# EAGLE design RDF4463_Beacon_v1 (EAGLE 6.5.0)
DRF4463F (si4463) APRS/CW Beacon Test Board
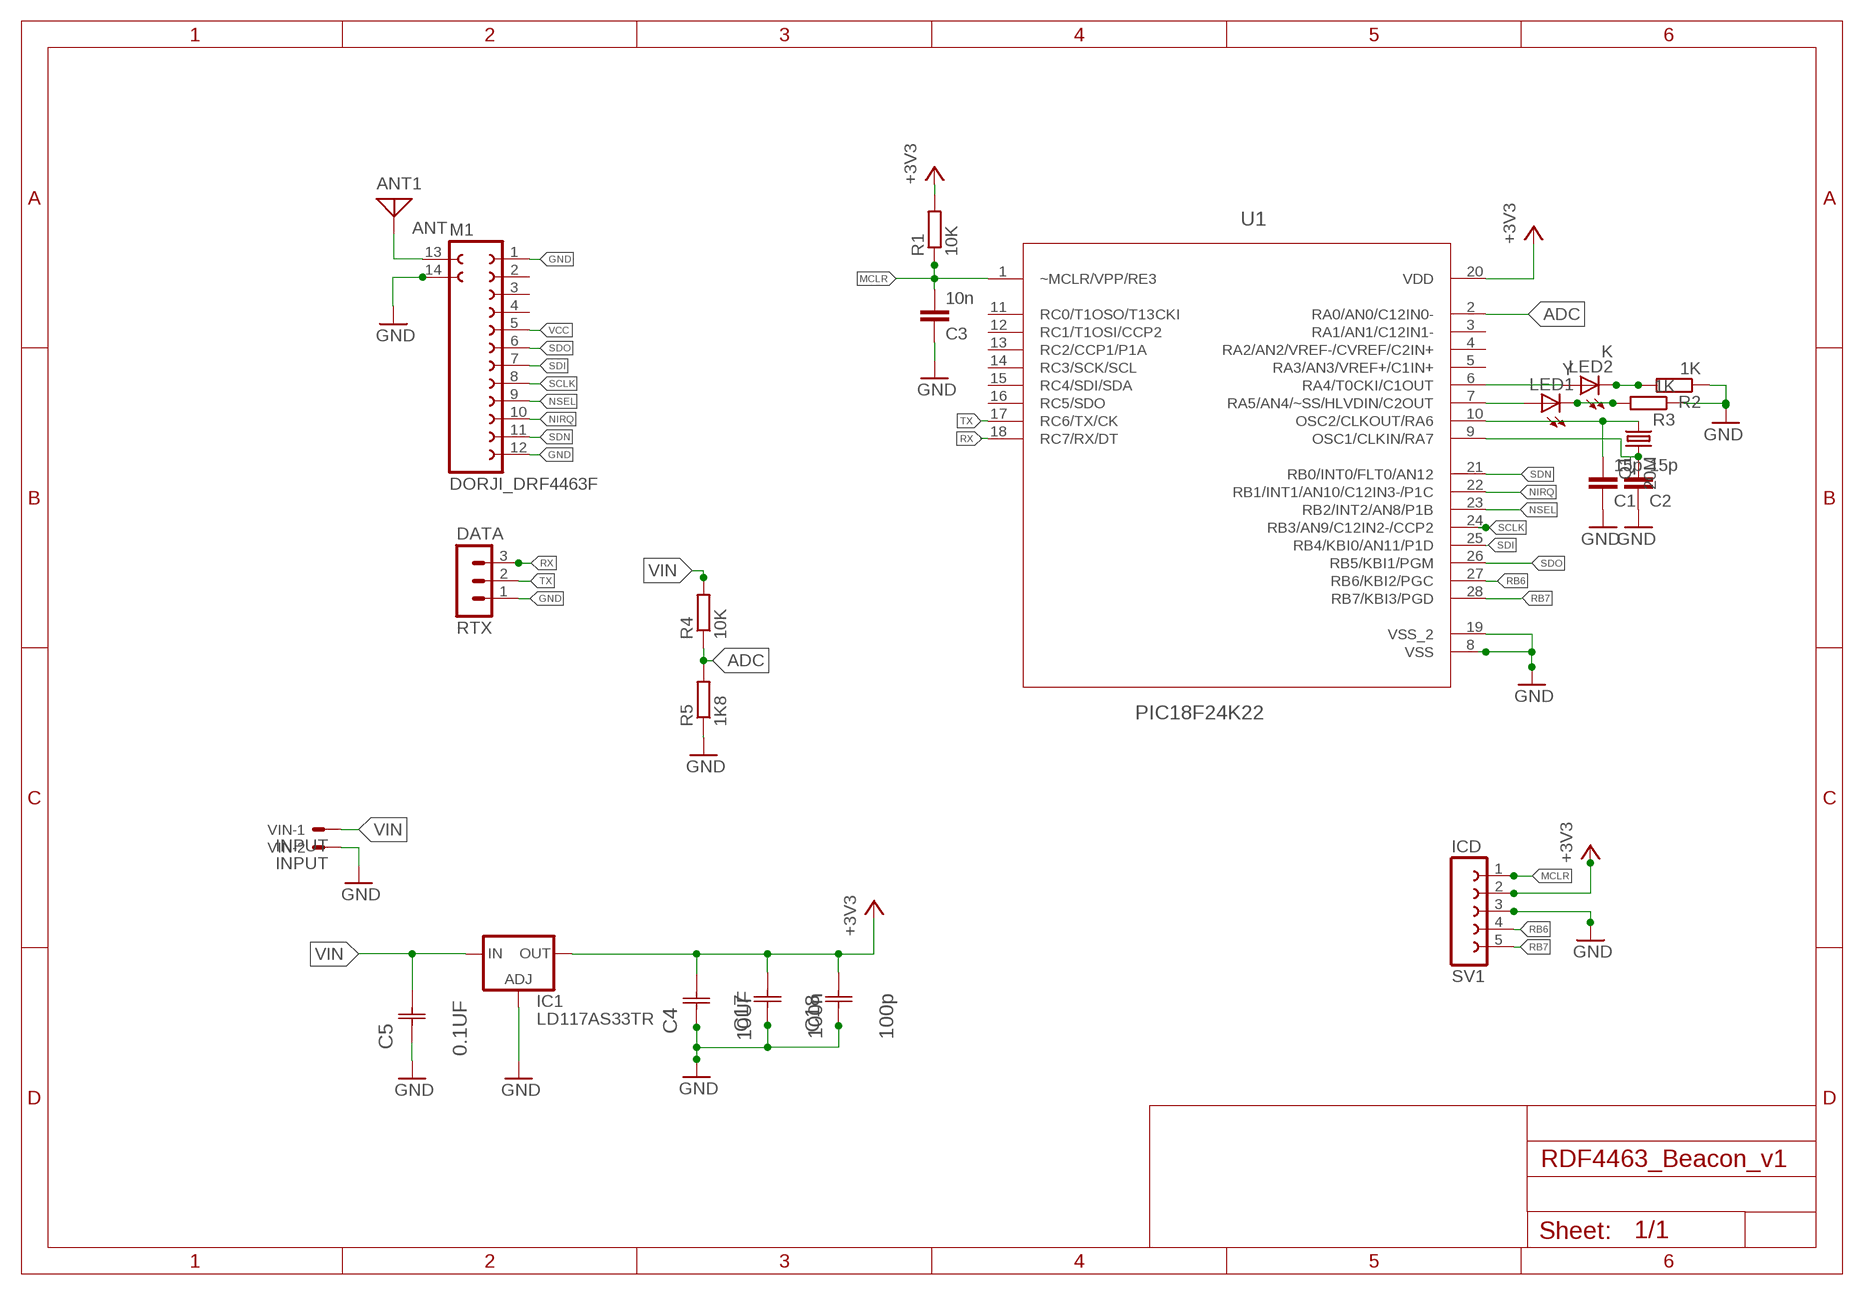
[diagram p0: schematic, sheet 1]

## Parts
ANT1  ANT  ANTENNA  [PAD-01]
C1  15p  C-EUC0805  [C0805]
C2  15p  C-EUC0805  [C0805]
C3  10n  C-EUC0805  [C0805]
C4  10UF  0805YD106MAT2A  [CAPC2013X140N]
C5  0.1UF  0805ZC104MAT2A  [CAPC2012X94N]
C17  100n  0805YD106MAT2A  [CAPC2013X140N]
C18  100p  0805YD106MAT2A  [CAPC2013X140N]
DATA  RTX  MA03-1  [MA03-1]
IC1  LD117AS33TR  [SOT223]
LED1  Y  LEDSML0805  [SML0805]
LED2  K  LEDSML0805  [SML0805]
M1  DORJI_DRF4463F  [DORJI_DRF4463F]
Q1  20M  CRYSTALSM49  [SM49]
R1  10K  R-EU_R0805  [R0805]
R2  1K  R-EU_R0805  [R0805]
R3  1K  R-EU_R0805  [R0805]
R4  10K  R-EU_R0805  [R0805]
R5  1K8  R-EU_R0805  [R0805]
SV1  ICD  FE05-1  [FE05-1]
U1  PIC18F24K22  [SSPO28]
VIN  INPUT  KK-156-2  [KK-156-2]

## Nets
ADC: R4.1 R5.2 U1.2(RA0/AN0/C12IN0-)
GND: C1.1 C2.1 C3.1 C4.1(C1) C5.1(C1) C17.1(C1) C18.1(C1) DATA.1 IC1.1(ADJ) M1.1 M1.12 M1.14 R2.1 R3.1 R5.1 SV1.3 U1.8(VSS) U1.19(VSS_2) VIN.2
MCLR: C3.2 R1.1 SV1.1 U1.1(~MCLR/VPP/RE3)
N$2: ANT1.1 M1.13
N$3: C2.2 Q1.2 U1.9(OSC1/CLKIN/RA7)
N$4: C1.2 Q1.1 U1.10(OSC2/CLKOUT/RA6)
N$6: LED1.A U1.7(RA5/AN4/~SS/HLVDIN/C2OUT)
N$7: LED2.A U1.6(RA4/T0CKI/C1OUT)
N$8: LED2.C R2.2
N$9: LED1.C R3.2
NIRQ: M1.10 U1.22(RB1/INT1/AN10/C12IN3-/P1C)
NSEL: M1.9 U1.23(RB2/INT2/AN8/P1B)
RB6: SV1.4 U1.27(RB6/KBI2/PGC)
RB7: SV1.5 U1.28(RB7/KBI3/PGD)
RX: DATA.3 U1.18(RC7/RX/DT)
SCLK: M1.8 U1.24(RB3/AN9/C12IN2-/CCP2)
SDI: M1.7 U1.25(RB4/KBI0/AN11/P1D)
SDN: M1.11 U1.21(RB0/INT0/FLT0/AN12)
SDO: M1.6 U1.26(RB5/KBI1/PGM)
TX: DATA.2 U1.17(RC6/TX/CK)
VCC: C4.2(C2) C17.2(C2) C18.2(C2) IC1.4(OUT) M1.5 R1.2 SV1.2 U1.20(VDD) ; supply symbol labelled +3V3
VIN: C5.2(C2) IC1.3(IN) R4.2 VIN.1
Unconnected: M1.2 M1.3 M1.4 U1.3(RA1/AN1/C12IN1-) U1.4(RA2/AN2/VREF-/CVREF/C2IN+) U1.5(RA3/AN3/VREF+/C1IN+) U1.11(RC0/T1OSO/T13CKI) U1.12(RC1/T1OSI/CCP2) U1.13(RC2/CCP1/P1A) U1.14(RC3/SCK/SCL) U1.15(RC4/SDI/SDA) U1.16(RC5/SDO)

## Library data of the parts
ANT1 = discrete:ANTENNA: Antenna
C1-C3 = rcl:C-EU: CAPACITOR, European symbol
C4 = AVX_By_element14_Batch_1:0805YD106MAT2A: Capacitor 0805; MPN: 0805YD106MAT2A; OC_FARNELL: 1582704; OC_NEWARK: 66M3391; SUPPLIER: AVX; TOLERANCE: ±20%; VOLTAGERATING: 16V
C5 = AVX_By_element14_Batch_1:0805ZC104MAT2A: Capacitor 0805; MPN: 0805ZC104MAT2A; OC_FARNELL: -; OC_NEWARK: 55J5552; SUPPLIER: AVX; TOLERANCE: ±20%; VOLTAGERATING: 10V
C17 C18 = AVX_By_element14_Batch_1:0805YD106MAT2A: Capacitor 0805; MPN: 0805YD106MAT2A; OC_FARNELL: 1582704; OC_NEWARK: 66M3391; SUPPLIER: AVX; TOLERANCE: ±20%; VALUE: 10UF; VOLTAGERATING: 16V
DATA = con-lstb:MA03-1: PIN HEADER; OC_FARNELL: unknown; OC_NEWARK: unknown
IC1 = v-reg:LD117A?*: Low drop fixed and adjustable positive voltage regulators 1 A Source: http://www.st.com/stonline/products/literature/ds/7194/ld1117axx.pdf
LED1 LED2 = led:LED: LED OSRAM: - CHIPLED LG R971, LG N971, LY N971, LG Q971, LY Q971, LO R971, LY R971 LH N974, LH R974 LS Q976, LO Q976, LY Q976 LO Q996 - Hyper CHIPLED LW Q18S LB Q993, LB Q99A, LB R99A - SideLED LS A670, LO A670, LY A670, LG A670, LP A670 LB A673, LV A673, LT A673, LW A673 LH A674 LY A675 LS A676, LA A676, LO A676, LY A676, LW A676 LS A679, LY A679, LG A679 - Hyper Micro SIDELED® LS Y876, LA Y876, LO Y876, LY Y876 LT Y87S - SmartLED LW L88C, LW L88S LB L89C, LB L89S, LG L890 LS L89K, LO L89K, LY L89K LS L896, LA L896, LO L896, LY L896 - TOPLED LS T670, LO T670, LY T670, LG T670, LP T670 LSG T670, LSP T670, LSY T670, LOP T670, LYG T670 LG T671, LOG T671, LSG T671 LB T673, LV T673, LT T673, LW T673 LH T674 LS T676, LA T676, LO T676, LY T676, LB T676, LH T676, LSB T676, LW T676 LB T67C, LV T67C, LT T67C, LS T67K, LO T67K, LY T67K, LW E67C LS E67B, LA E67B, LO E67B, LY E67B, LB E67C, LV E67C, LT E67C LW T67C LS T679, LY T679, LG T679 LS T770, LO T770, LY T770, LG T770, LP T770 LB T773, LV T773, LT T773, LW T773 LH T774 LS E675, LA E675, LY E675, LS T675 LS T776, LA T776, LO T776, LY T776, LB T776 LHGB T686 LT T68C, LB T68C - Hyper Mini TOPLED® LB M676 - Mini TOPLED Santana® LG M470 LS M47K, LO M47K, LY M47K Source: http://www.osram.convergy.de LUXEON: - LUMILED® LXK2-PW12-R00, LXK2-PW12-S00, LXK2-PW14-U00, LXK2-PW14-V00 LXK2-PM12-R00, LXK2-PM12-S00, LXK2-PM14-U00 LXK2-PE12-Q00, LXK2-PE12-R00, LXK2-PE12-S00, LXK2-PE14-T00, LXK2-PE14-U00 LXK2-PB12-K00, LXK2-PB12-L00, LXK2-PB12-M00, LXK2-PB14-N00, LXK2-PB14-P00, LXK2-PB14-Q00 LXK2-PR12-L00, LXK2-PR12-M00, LXK2-PR14-Q00, LXK2-PR14-R00 LXK2-PD12-Q00, LXK2-PD12-R00, LXK2-PD12-S00 LXK2-PH12-R00, LXK2-PH12-S00 LXK2-PL12-P00, LXK2-PL12-Q00, LXK2-PL12-R00 Source: www.luxeon.com KINGBRIGHT: KA-3528ASYC Source: www.kingbright.com
M1 = beacon_malzemeler:DORJI_DRF4463F
Q1 = crystal:CRYSTAL: CRYSTAL; OC_FARNELL: unknown; OC_NEWARK: unknown
R1-R5 = rcl:R-EU_: RESISTOR, European symbol
SV1 = con-lsta:FE05-1: FEMALE HEADER; OC_FARNELL: unknown; OC_NEWARK: unknown
U1 = beacon_malzemeler:PIC18F24K22
VIN = con-molex:KK-156-2: KK 156 HEADER Source: http://www.molex.com/pdm_docs/sd/026604100_sd.pdf; OC_FARNELL: unknown; OC_NEWARK: unknown

## Board
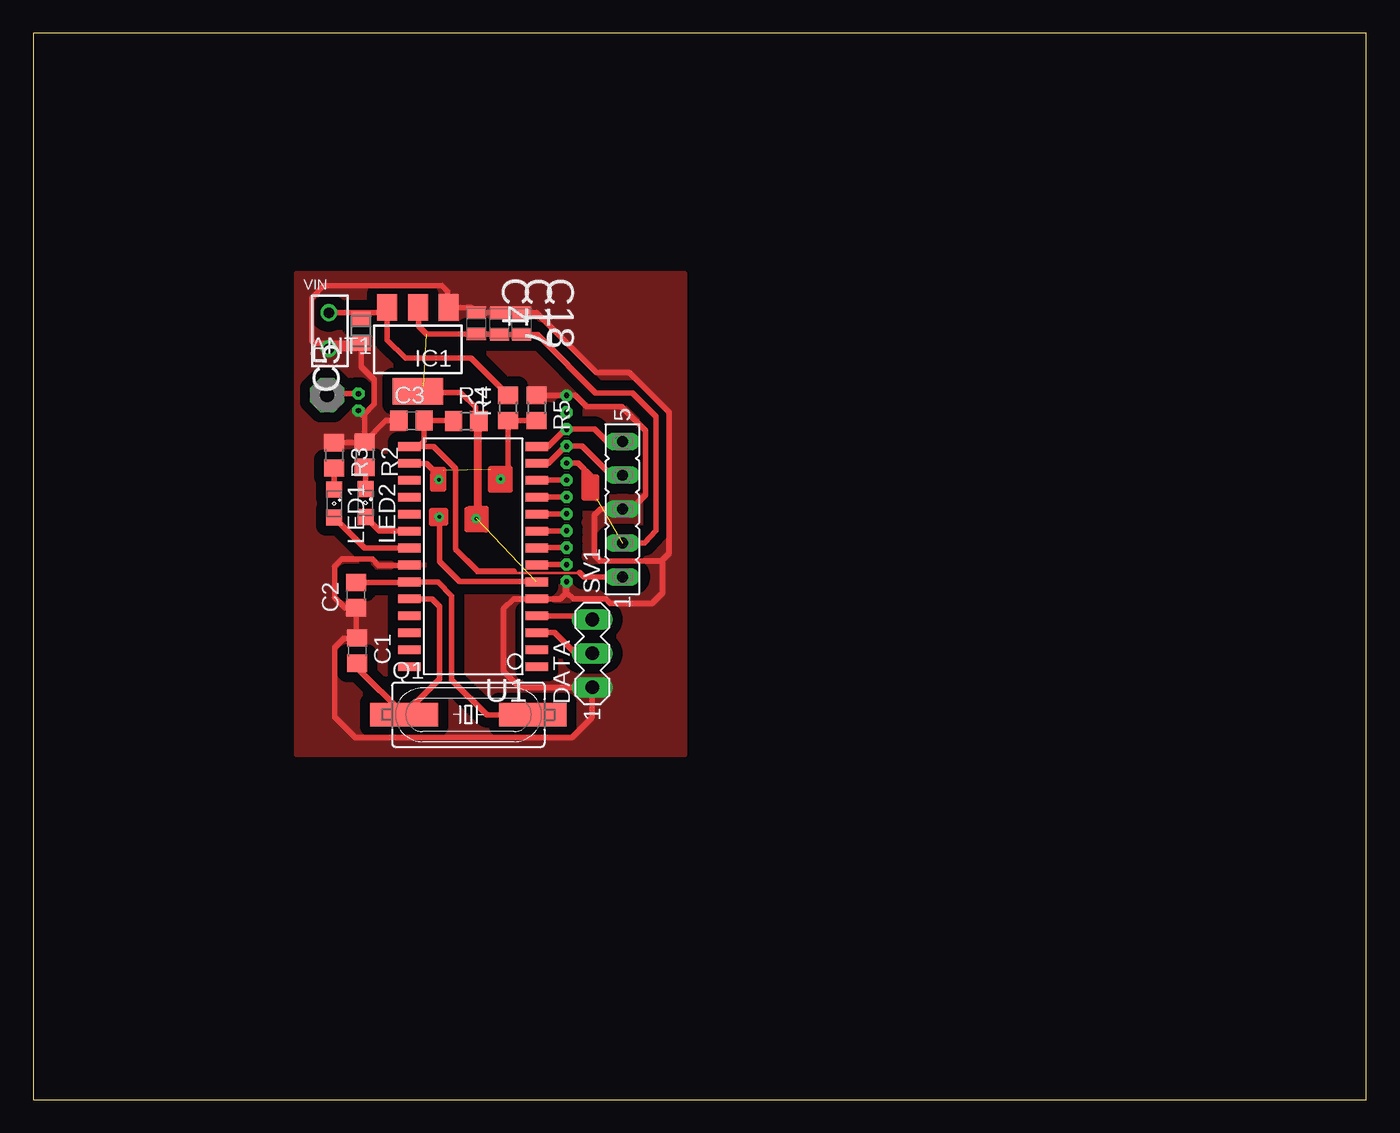
[diagram p1: board, top side]
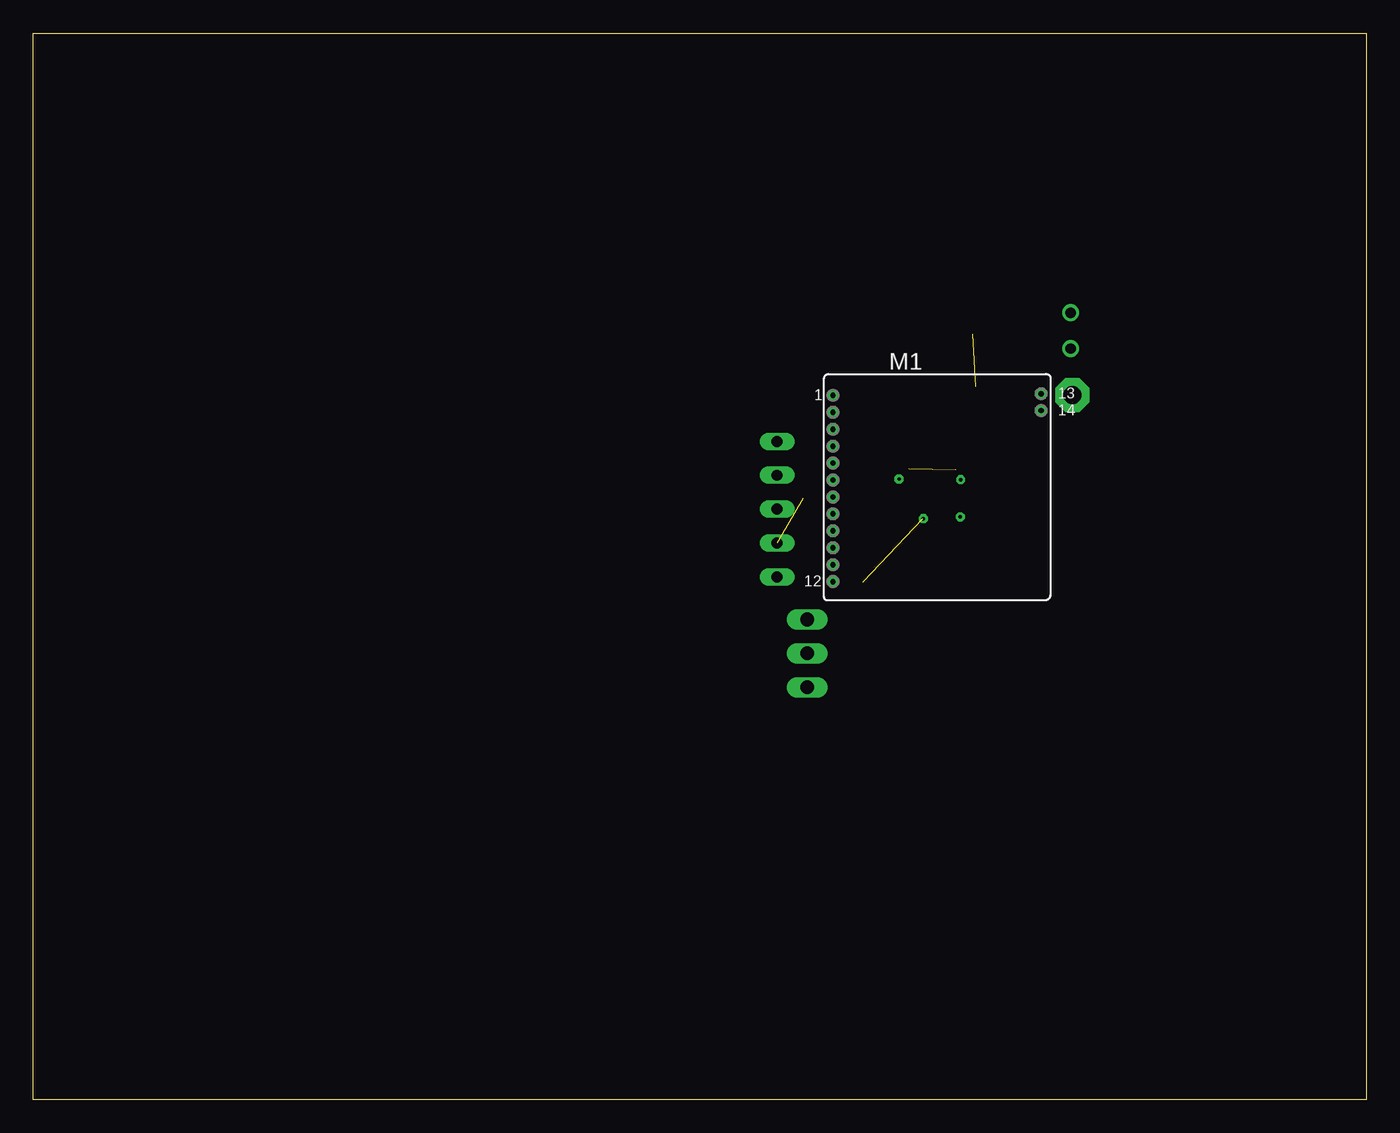
[diagram p2: board, bottom side, seen from below]

Size 100 x 80 mm. Coordinates in mm from the lower left corner, seen from the top.
Outline: 0,0 100,0 100,80 0,80 0,0
Copper layers (1*16): Top 0.035mm / dielectric 1.5mm / Bottom 0.035mm
Design rules "default": minimum track width 10mil, minimum drill 24mil, track to track 8mil, track to pad 8mil, pad to pad 8mil, via to via 8mil, smd to smd 8mil, copper to edge 40mil, drill to drill 8mil, minimum pad ring 10mil, minimum via ring 8mil, stop-mask expansion 4mil, vias tented up to drill 0mil, thermal gap 10mil

### Footprints (pad centres in the part's own frame; a part is rotated, then mirrored left to right if it is on the bottom)
PAD-01 = drill 1.321 pad 2.54 octagon: 1 0,0
C0805 = smd 1.3 x 1.5: 1 -0.95,0; 2 0.95,0
CAPC2013X140N = smd 0.914 x 1.448: 1 -0.813,0; 2 0.813,0
CAPC2012X94N = smd 1.118 x 1.448: 1 -0.914,0; 2 0.914,0
MA03-1 = drill 1.016 long: 1 -2.54,0; 2 0,0; 3 2.54,0
SOT223 = smd 1.5 x 2: 1 -2.3,-3.15; 2 0,-3.15; 3 2.3,-3.15 | smd 3.8 x 2: 4 0,3.15
SML0805 = smd 1.2 x 1.2: A 1.05,0; C -1.05,0
DORJI_DRF4463F = drill 0.4 pad 0.8: 1 -8.255,7.112 | drill 0.4 pad 0.8 octagon: 2 -8.255,5.842; 3 -8.255,4.572; 4 -8.255,3.302; 5 -8.255,2.032; 6 -8.255,0.762; 7 -8.255,-0.508; 8 -8.255,-1.778; 9 -8.255,-3.048; 10 -8.255,-4.318; 11 -8.255,-5.588; 12 -8.255,-6.858; 13 7.366,7.239; 14 7.366,5.969
SM49 = smd 5.08 x 1.778: 1 -4.826,0; 2 4.826,0
R0805 = smd 1.3 x 1.5: 1 -0.95,0; 2 0.95,0
FE05-1 = drill 0.813 long: 1 -5.08,0; 2 -2.54,0; 3 0,0; 4 2.54,0; 5 5.08,0
SSPO28 = smd 1.7 x 0.65: 1 -4.78,7.62; 2 -4.78,6.35; 3 -4.78,5.08; 4 -4.78,3.81; 5 -4.78,2.54; 6 -4.78,1.27; 7 -4.78,0; 8 -4.78,-1.27; 9 -4.78,-2.54; 10 -4.78,-3.81; 11 -4.78,-5.08; 12 -4.78,-6.35; 13 -4.78,-7.62; 14 -4.78,-8.89; 15 4.78,-8.89; 16 4.78,-7.62; 17 4.78,-6.35; 18 4.78,-5.08; 19 4.78,-3.81; 20 4.78,-2.54; 21 4.78,-1.27; 22 4.78,0; 23 4.78,1.27; 24 4.78,2.54; 25 4.78,3.81; 26 4.78,5.08; 27 4.78,6.35; 28 4.78,7.62
KK-156-2 = drill 0.762 pad 1.27: 1 -0.71,0; 2 1.98,0

### Placement (x,y rotation side)
ANT1  22.05,52.86 0 top
C1  24.31,33.68 270 top
C2  24.21,37.85 90 top
C3  28.37,50.93 0 top
C4  33.25,58.24 270 top
C5  24.59,57.66 90 top
C17  34.98,58.22 270 top
C18  36.63,58.22 270 top
DATA  41.94,33.48 90 top
IC1  28.85,56.29 180 top
LED1  22.58,44.7 270 top
LED2  24.92,44.75 270 top
M1  31.75,45.72 0 bottom
Q1  32.64,28.88 0 top
R1  32.49,50.9 0 top
R2  24.84,48.39 270 top
R3  22.58,48.34 270 top
R4  35.64,51.89 90 top
R5  37.74,51.89 270 top
SV1  44.2,44.3 90 top
U1  32.99,41.38 0 top
VIN  22.17,58.32 270 top

### Tracks (layer width: path | path; a pad name or v marks a point on that pad's centre or on a via)
ADC  (1 unrouted)
  Top 0.406: R5.2 R4.1 35.64,47.35 34.34,47.35 34.31,47.32 34.31,45.74 35.74,45.74 35.76,45.72 35.76,47.35 34.98,47.35 34.7,47.07 34.7,45.97 34.67,45.95 35.43,45.95 35.56,46.08 35.56,47.07 34.92,47.07 34.87,47.02 34.87,46.18 34.92,46.13 35.28,46.13 35.38,46.23 35.38,46.69 35.23,46.84 35.23,46.48 35.18,46.43 | U1.2 29.49,47.73 29.95,47.27 30.73,47.27 30.79,47.22 30.79,46.81 | 30.79,46.81 30.73,46.76 30.02,46.76 30,46.79 30,47.02 30.5,47.02 | 30.79,46.81 30.79,45.82 29.95,45.82 29.95,46.84 30.02,46.91 30.02,46.58 30.25,46.35 30.25,46.08 30.28,46.05 30.48,46.05 30.53,46.1 30.53,46.56 30.5,46.58
GND
  Top 0.406: U1.8 28.19,40.08 25.91,40.08 25.45,40.54 23.14,40.54 22.61,40.01 22.61,37.67 23.38,36.9 C2.1 24.21,34.73 C1.1 24.27,34.59 23.27,34.59 22.61,33.93 22.61,28.7 24.13,27.18 40.44,27.18 41.94,28.68 DATA.1 36.47,30.94 35.28,32.13 35.28,36.83 36.02,37.57 U1.19 39.52,37.57 39.93,37.97 39.93,38.79 M1.12 40.01,38.05 40.51,37.54 42.95,37.54 43.26,37.24 46.41,37.24 47.19,38.02 47.19,40.28 47.07,40.41 | R3.1 24.79,49.29 R2.1 | M1.1 37.76,52.83 R5.1 40.66,52.84 41.5,51.99 44.12,51.99 45.92,50.19 45.92,45.34 44.93,44.35 44.25,44.35 SV1.3 42.57,44.3 42.11,43.84 42.11,40.82 42.52,40.41 47.07,40.41 | C3.1 26.43,50.93 R2.1 | R2.1 24.84,51.23 24.74,51.33 | 24.74,51.33 M1.14 | VIN.2 24.18,56.34 C5.1 | C5.1 24.59,54.99 25.58,54 25.58,52.17 24.74,51.33 | C5.1 21.08,56.74 20.88,56.95 20.88,60.15 21.79,61.06 30.66,61.06 31.09,60.63 31.09,59.5 IC1.1 32.87,59.44 C4.1 34.95,59.05 C17.1 C18.1 37.74,59.03 42.24,54.53 42.34,54.53 42.37,54.56 44.73,54.56 47.7,51.59 47.7,40.97 47.14,40.41 47.07,40.41
  pour Top (isolate 0.762, rank 2, no thermals): 19.76,61.98 19.76,25.88 48.84,25.88 48.84,61.98 19.79,61.98
MCLR
  Top 0.203: SV1.1 41.15,39.22 40.87,39.5 33.27,39.5 31.6,41.17 31.6,47.27 29.87,49 28.93,49 28.4,49 U1.1
  Top 0.406: R1.1 31.51,50.93 C3.2 29.32,49.39 28.93,49 | 28.4,49 30.05,49 31.7,47.35 31.7,41.3 33.35,39.65 36.04,39.65 36.07,39.62
N$2
  Top 0.406: M1.13 22.15,52.96 ANT1.1
N$3
  Top 0.406: C2.2 28.17,38.8 U1.9 30.35,38.84 31.39,37.8 31.39,31.5 34.04,28.85 36.68,28.85 36.8,28.73 37.31,28.73 Q1.2
N$4
  Top 0.406: C1.2 24.31,32.38 Q1.1 30.48,31.55 30.48,37.01 29.92,37.57 U1.10
N$6
  Top 0.406: U1.7 24.86,41.38 LED1.A
N$7
  Top 0.406: U1.6 25.98,42.65 LED2.A
N$8
  Top 0.406: R2.2 24.92,47.44 LED2.C
N$9
  Top 0.406: R3.2 LED1.C
N$10
  Top 0.406: 44.27,39.22 41.33,39.22 41,39.55
N$11
  Top 0.406: 37.77,38.89 31.98,38.89 30.48,40.39 30.48,43.18 30.5,43.2 29.9,43.2 29.9,44.17 29.92,44.2 30.91,44.2 30.94,44.17 30.94,43.26 30.33,43.26 30.15,43.43 30.15,43.87 30.58,43.87 30.61,43.89 30.61,43.59 30.66,43.54 30.4,43.54
N$12
  Top 0.406: 32.54,44.27 32.54,42.77 33.93,42.77 33.96,42.75 33.96,44.35 32.72,44.35 32.66,44.3 32.69,44.3 32.87,44.12 32.87,43.05 33.66,43.05 33.68,43.03 33.68,44.07 33.71,44.09 33.12,44.09 33.07,44.04 33.07,43.36 33.17,43.26 33.33,43.26 33.35,43.28 33.35,43.84 33.38,43.87
N$13  (via drill 0.25)
  other vias: 30.43,46.51
N$14  (via drill 0.25)
  other vias: 35.05,46.56
N$15  (via drill 0.25)
  other vias: 30.45,43.71
N$16  (via drill 0.25)
  other vias: 33.22,43.59
NIRQ
  Top 0.406: M1.10 37.8,41.4 U1.22
NSEL
  Top 0.406: M1.9 37.8,42.67 U1.23
RB6
  Top 0.406: U1.27 38.61,47.73 39.93,49.05 41.17,49.05 43.36,46.86 44.17,46.86 SV1.4
RB7
  Top 0.406: U1.28 38.61,49 39.93,50.32 42.09,50.32 43.05,49.35 44.17,49.35 SV1.5
RX
  Top 0.406: U1.18 41.66,36.3 DATA.3
SCLK
  Top 0.406: M1.8 37.8,43.94 U1.24
SDI
  Top 0.406: M1.7 37.8,45.21 U1.25
SDN
  Top 0.406: M1.11 37.8,40.13 U1.21
SDO
  Top 0.406: M1.6 37.8,46.48 U1.26
TX
  Top 0.406: U1.17 39.12,35.03 40.62,33.53 41.88,33.53 DATA.2
VCC  (3 unrouted)
  Top 0.406: SV1.2 45.87,41.76 46.74,42.7 46.74,51.26 44.96,53.01 42.19,53.01 40.13,55.07 40.13,55.09 37.82,57.4 C18.2 C17.2 34.95,57.43 C4.2 29.49,57.43 28.91,58.01 28.91,59.33 28.88,59.36 28.88,59.64 28.93,59.69 | IC1.4 28.96,53.14 29.3,53.48 29.44,53.34 29.44,52.98 29.52,53.06 32.05,53.06 33.17,51.94 33.17,51.1 33.27,51 33.27,43.59 33.44,43.75 R1.2 | M1.5 40.87,47.75 41.33,47.3 41.33,45.16 41.35,45.14 42.24,45.14 42.27,45.11 42.27,46.71 41.94,46.71 41.48,47.17 41.48,46.56 41.66,46.38 41.66,45.62 41.55,45.52 41.81,45.52 41.94,45.39 41.94,45.8 41.99,45.85 41.99,46.13 42.11,46.25 42.11,46.38 42.09,46.41 41.88,46.41 41.71,46.58 41.71,46.08 42.11,45.67
VIN
  Top 0.406: C5.2 24.13,59.03 VIN.1 26.15,59.03 IC1.3 26.55,56.99 27.91,55.63 32.85,55.63 R4.2